# EAGLE design PCB-RPIBO1_SDEXT (EAGLE 6.5.0)
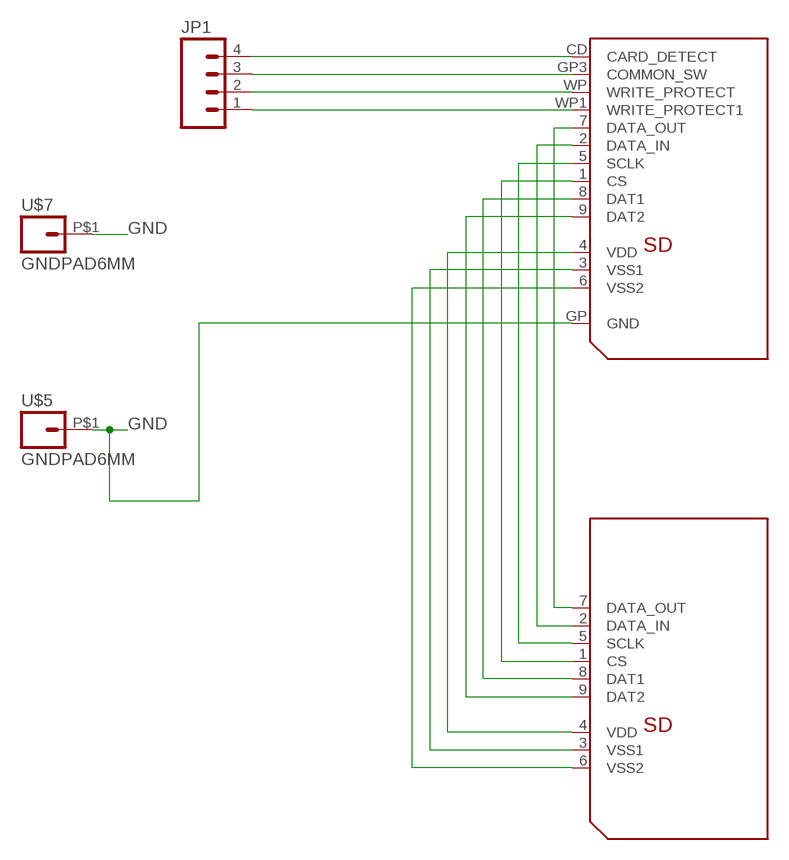
[diagram p0: schematic, sheet 1]

## Parts
JP1  M04PTH  [1X04]
U$2  SD06132  [SD_LARGE]
U$4  SDMALEPCB  [SD_MALEPCB]
U$5  GNDPAD6MM  [3.2MMPAD6MM]
U$7  GNDPAD6MM  [3.2MMPAD6MM]

## Nets
GND [Power]: U$2.GP(GND) U$5.P$1 U$7.P$1
N$1: U$2.7(DATA_OUT) U$4.7(DATA_OUT)
N$2: U$2.2(DATA_IN) U$4.2(DATA_IN)
N$3: U$2.5(SCLK) U$4.5(SCLK)
N$4: U$2.1(CS) U$4.1(CS)
N$5: U$2.8(DAT1) U$4.8(DAT1)
N$6: U$2.9(DAT2) U$4.9(DAT2)
N$7: JP1.4 U$2.CD(CARD_DETECT)
N$8: JP1.3 U$2.GP3(COMMON_SW)
N$9: JP1.2 U$2.WP(WRITE_PROTECT)
N$10: JP1.1 U$2.WP1(WRITE_PROTECT1)
VDD: U$2.4(VDD) U$4.4(VDD)
VSS1: U$2.3(VSS1) U$4.3(VSS1)
VSS2: U$2.6(VSS2) U$4.6(VSS2)

## Library data of the parts
JP1 = SparkFun:M04: Header 4 Standard 4-pin 0.1" header. Use with straight break away headers (SKU : PRT-00116), right angle break away headers (PRT-00553), swiss pins (PRT-00743), machine pins (PRT-00117), and female headers (PRT-00115). Molex polarized connector foot print use with SKU : PRT-08231 with associated crimp pins and housings. 1MM SMD Version SKU: PRT-10208
U$2 = SKAARHOJ:SD: SD MMC Card holder 4UCON part #06132 - easy to solder
U$4 = SKAARHOJ:SDMALEPCB
U$5 U$7 = SKAARHOJ:GNDPAD

## Net classes
0 default: width 0.203 mm, drill 0.406 mm, clearance 0.152 mm
1 Power: width 0.508 mm, drill 0.61 mm, clearance 0.203 mm
3 INput lines: clearance 0.203 mm

## Board
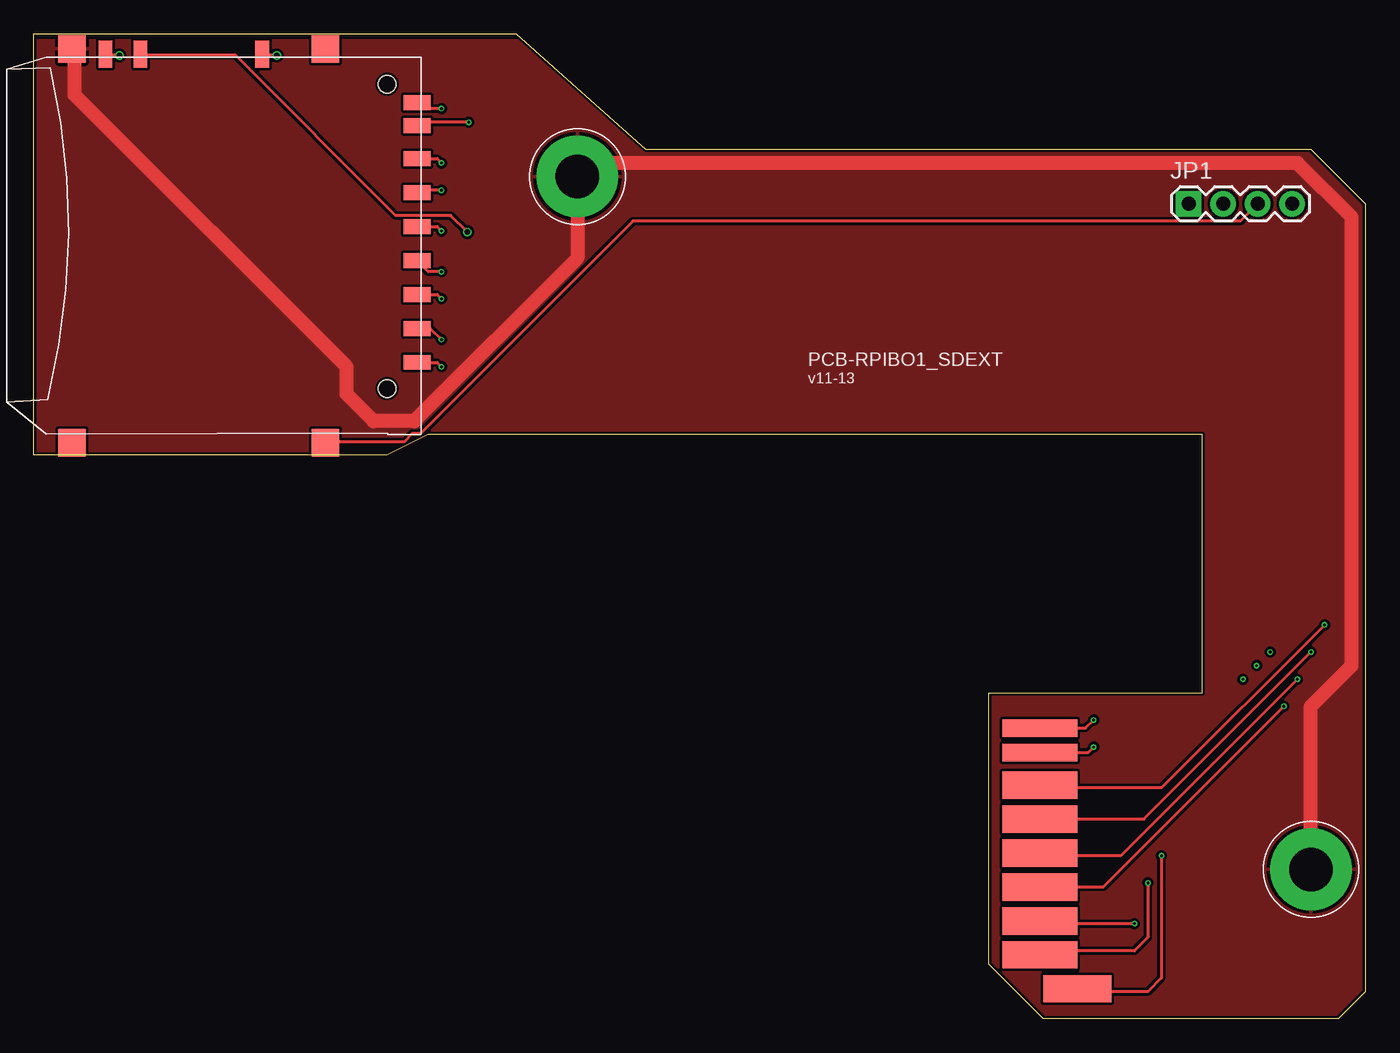
[diagram p1: board, top side]
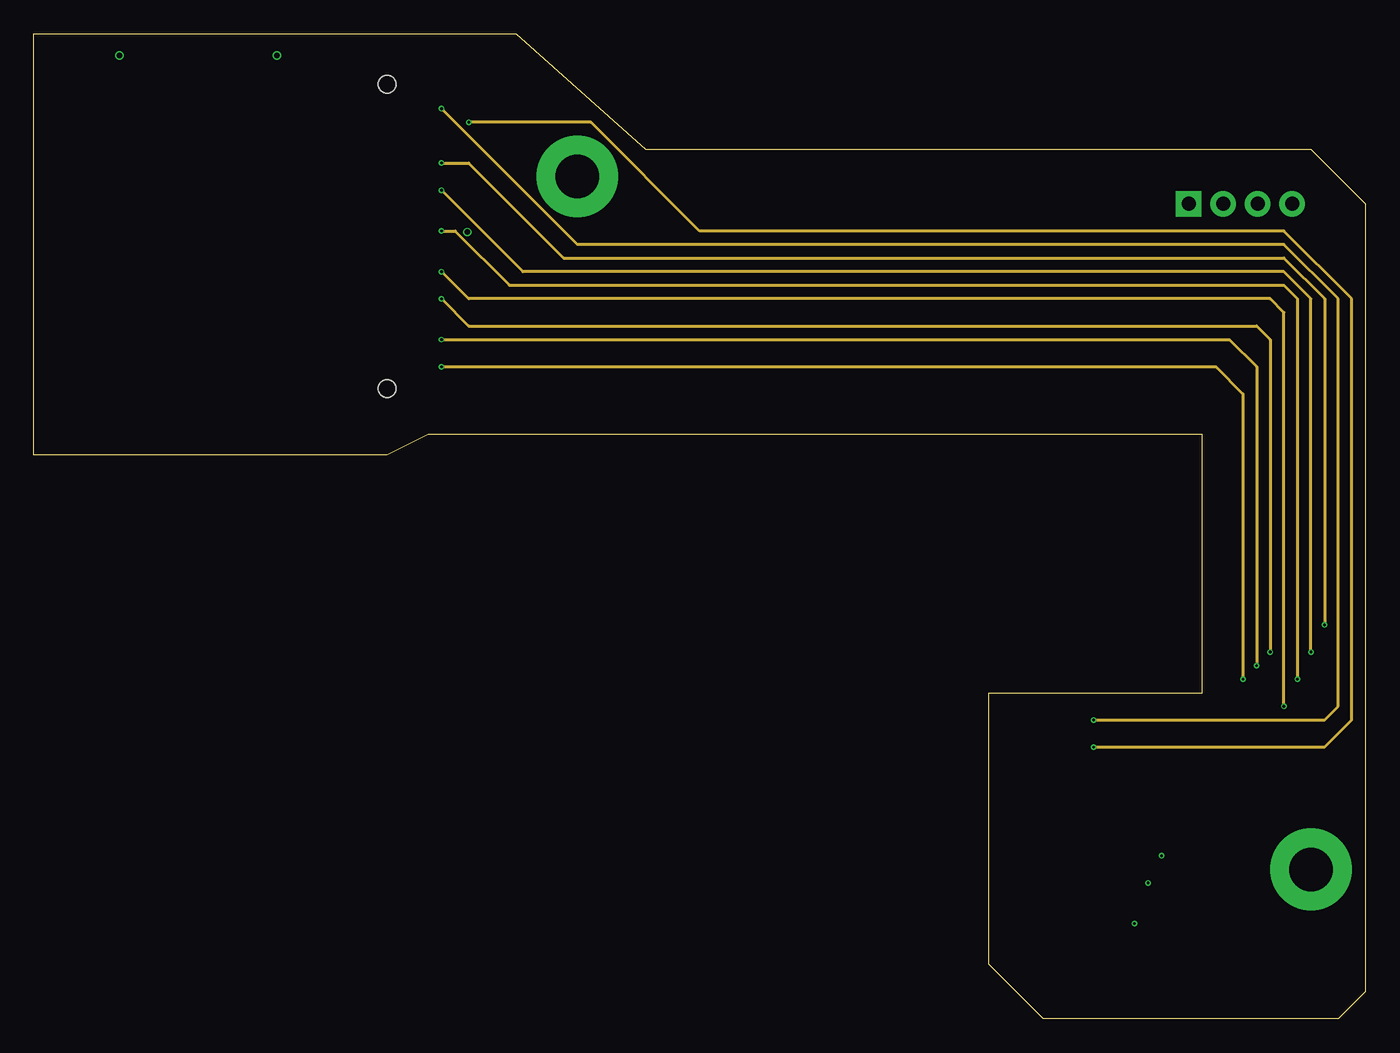
[diagram p2: board, inner layer Route2]
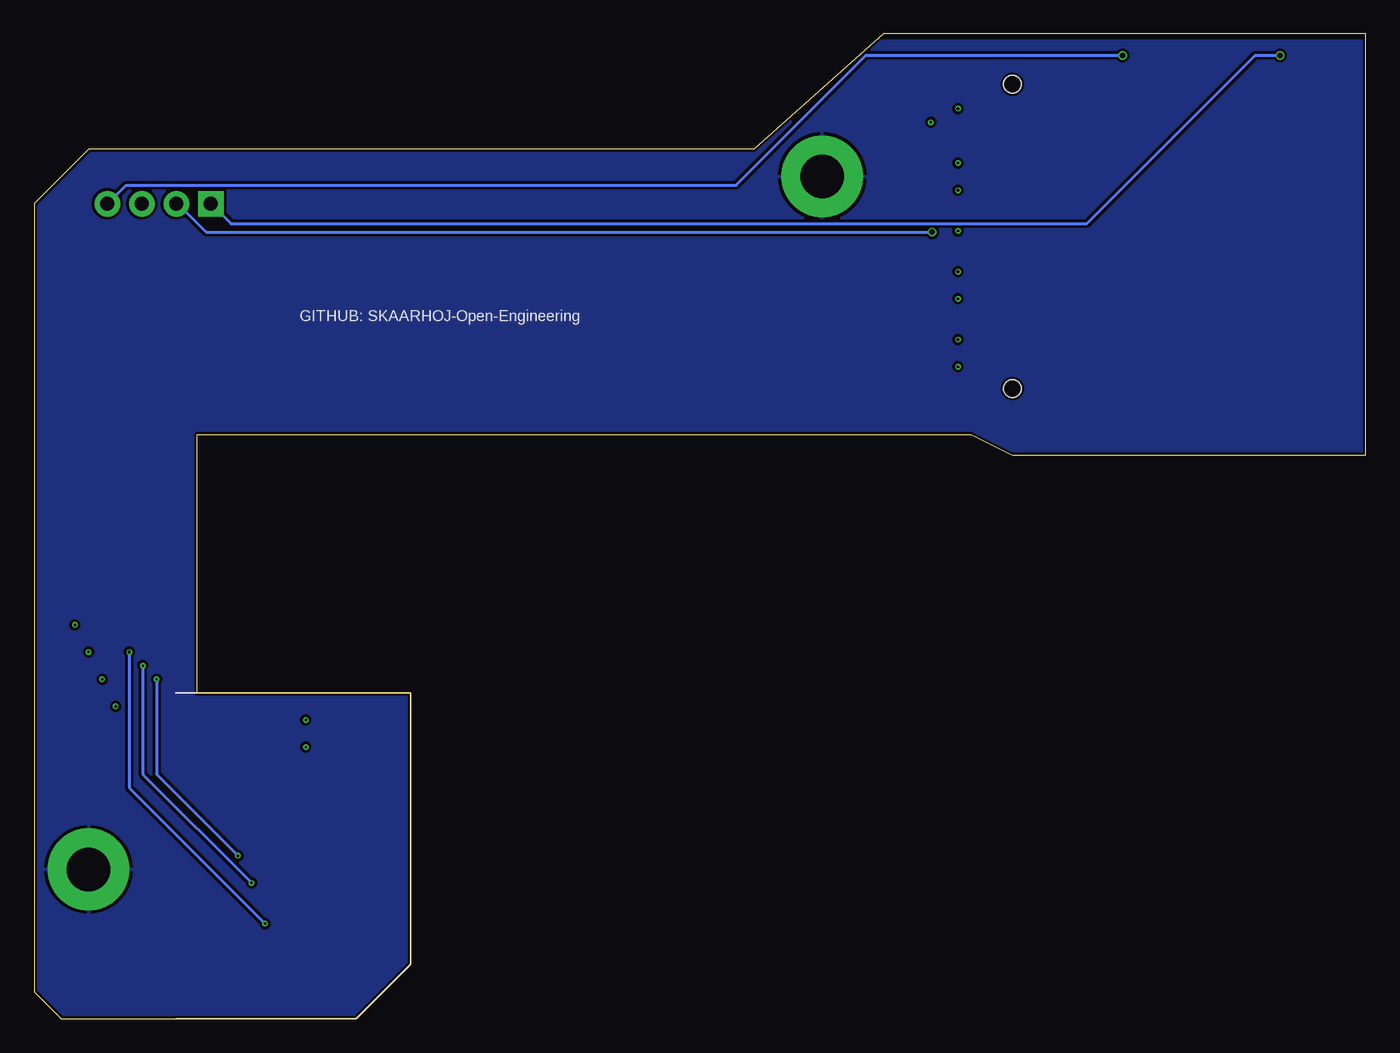
[diagram p3: board, bottom side, seen from below]

Size 98 x 72.5 mm. Coordinates in mm from the lower left corner, seen from the top.
Outline: 74.3,0 70.3,4 70.3,24 86,24 86,43 29,43 26,41.5 0,41.5 0,72.5 35.5,72.5 45,64 94,64 98,60 98,2 96,0 74.3,0
Copper layers (1*2*15*16): Top 0.035mm / dielectric 0.2mm / Route2 0.0175mm / dielectric 0.3mm / Route15 0.0175mm / dielectric 0.2mm / Bottom 0.035mm
Design rules "SeeedStudio_DRU-4layer_no_angle_20130527": minimum track width 4mil, minimum drill 0.2mm, track to track 6mil, track to pad 6mil, pad to pad 6mil, via to via 6mil, smd to smd 0mil, copper to edge 8mil, drill to drill 8mil, minimum pad ring 6mil, minimum via ring 4mil, stop-mask expansion 4mil, vias tented up to drill 100mil, thermal gap 10mil

### Footprints (pad centres in the part's own frame; a part is rotated, then mirrored left to right if it is on the bottom)
1X04 = drill 1.016 pad 1.88 square: 1 0,0 | drill 1.016 pad 1.88: 2 2.54,0; 3 5.08,0; 4 7.62,0
SD_LARGE = smd 1.1 x 2: 1 6.775,2.2; 2 4.275,2.2; 3 1.775,2.2; 4 -0.725,2.2; 5 -3.225,2.2; 6 -5.725,2.2; 7 -8.15,2.2; 8 -9.85,2.2; 9 9.275,2.2 | smd 2 x 1: CD -13.4,-9.2; WP -13.4,-18.15; WP1 -13.4,-20.75 | smd 2 x 2: GP -13.8,-23.2; GP2 15.2,-23.2; GP3 15.2,-4.55; GP4 -13.8,-4.55 | hole 1.3: -11.2,0; 11.2,0
SD_MALEPCB = smd 2 x 5.5 bottom: 1 7.3,-3.75; 2 4.8,-3.75; 3 2.3,-3.75; 4 -0.2,-3.75; 5 -2.7,-3.75; 6 -5.2,-3.75 | smd 1.3 x 5.5 bottom: 7 -7.6,-3.75; 8 -9.4,-3.75 | smd 2 x 5 bottom: 9 9.8,-6.5
3.2MMPAD6MM = drill 3.2 pad 6: P$1 0,0

### Placement (x,y rotation side)
JP1  85,60 0 top
U$2  26,57.6 270 top
U$4  70.3,12 270 bottom
U$5  40,62 0 top
U$7  94,11 0 top

### Tracks (layer width: path | path; a pad name or v marks a point on that pad's centre or on a via)
GND
  Top 1.016: U$7.P$1 94,23 97,26 97,59 93,63 41,63 U$5.P$1 40,56 28,44 25,44 23,46 23,48 3,68 3,71.2 U$2.GP
  pour Bottom: 0,0 98,0 98,72 0,72
  pour Top: 0,0 98,0 98,72 0,72
N$1  (via drill 0.2)
  Top 0.203: U$4.7 77.6,19.6 v78,20 | v32,66 28.45,66 U$2.7
  Route2 0.203: v78,20 95,20 97,22 97,53 92,58 49,58 41,66 v32,66
N$2  (via drill 0.2)
  Top 0.203: U$2.2 29.68,53.33 v30,53 | v81,7 74.25,7 U$4.2
  Route2 0.203: v30,53 32,51 90,51 91,50 v91,27
  Bottom 0.203: v91,27 91,17 v81,7
N$3  (via drill 0.2)
  Top 0.203: U$4.5 81.7,14.7 v94,27 | v30,61 28.38,61 U$2.5
  Route2 0.203: v94,27 94,53 92,55 36,55 v30,61
N$4  (via drill 0.2)
  Top 0.203: U$2.1 29.18,50.83 v30,50 | v82,10 82,6 81,5 74.35,5 U$4.1
  Route2 0.203: v30,50 88,50 90,48 v90,26
  Bottom 0.203: v90,26 90,18 v82,10
N$5  (via drill 0.2)
  Top 0.203: U$4.8 77.4,21.4 v78,22 | v30,67 28.65,67 U$2.8
  Route2 0.203: v78,22 95,22 96,23 96,53 92,57 40,57 v30,67
N$6  (via drill 0.2)
  Top 0.203: U$2.9 29.68,48.33 v30,48 | v83,12 83,3 82,2 77,2 U$4.9
  Route2 0.203: v30,48 87,48 89,46 v89,25
  Bottom 0.203: v89,25 89,18 v83,12
N$7  (via drill 0.41)
  Top 0.203: v17.88,70.92 16.87,70.92 U$2.CD
  Bottom 0.203: v17.88,70.92 36.78,70.92 46.33,61.37 91.24,61.37 92.46,60.15 JP1.4
N$8
  Top 0.203: U$2.GP3 21.54,42.47 27.23,42.47 27.84,43.08 28.45,43.08 44.09,58.73 88.8,58.73 90.02,59.94 JP1.3
N$9  (via drill 0.41)
  Top 0.203: v31.9,57.91 30.68,59.13 26.62,59.13 14.83,70.92 7.92,70.92 U$2.WP
  Bottom 0.203: v31.9,57.91 85.34,57.91 87.38,59.94 JP1.2
N$10  (via drill 0.41)
  Top 0.203: v6.3,70.92 5.28,70.92 U$2.WP1
  Bottom 0.203: v6.3,70.92 8.13,70.92 20.52,58.52 83.52,58.52 84.94,59.94 JP1.1
VDD  (via drill 0.2)
  Top 0.203: U$2.4 29.68,58.33 v30,58 | v93,25 80,12 74.25,12 U$4.4
  Route2 0.203: v30,58 31,58 35,54 92,54 93,53 v93,25
VSS1  (via drill 0.2)
  Top 0.203: U$4.3 78.7,9.7 v92,23 | v30,55 29.02,55 U$2.3
  Route2 0.203: v92,23 92,52 91,53 32,53 v30,55
VSS2  (via drill 0.2)
  Top 0.203: U$2.6 29.68,63.33 v30,63 | 74.25,17 U$4.6 73.85,17 | v95,29 83,17 73.85,17 | 73,17 73.85,17
  Route2 0.203: v30,63 32,63 39,56 92,56 95,53 v95,29

### Text on the board
_tsilk: PCB-RPIBO1_SDEXT | v11-13
_bsilk: GITHUB: SKAARHOJ-Open-Engineering